# EAGLE design LiPoCharger (EAGLE 8.0.1)
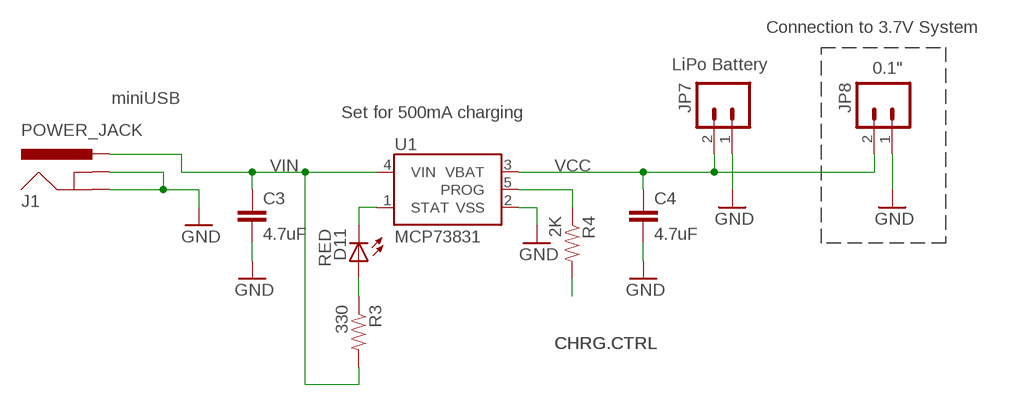
[diagram p0: schematic, sheet 1]

## Parts
C3  4.7uF  CAP0402-CAP  [0402-CAP]
C4  4.7uF  CAP0402-CAP  [0402-CAP]
D11  RED  LED0603  [LED-0603]
J1  POWER_JACK  [POWER_JACK_PTH]
JP7  LiPo Battery  M02-JST-2MM-SMT  [JST-2-SMD]
JP8  M02PTH  [1X02]
R3  330  RESISTOR0402-RES  [0402-RES]
R4  2K  RESISTOR0402-RES  [0402-RES]
U1  MCP73831  [SOT23-5]

## Nets
CHRG.CTRL: R4.2
GND: C3.2 C4.2 J1.GND J1.GNDBREAK JP7.1 JP8.1 U1.2(VSS)
N$3: D11.A R3.1
PROG: R4.1 U1.5(PROG)
STAT: D11.C U1.1(STAT)
VCC: C4.1 JP7.2 JP8.2 U1.3(VBAT)
VIN: C3.1 J1.PWR R3.2 U1.4(VIN)

## Notes on the sheet
- Connection to 3.7V System
- 0.1"
- miniUSB
- Set for 500mA charging

## Library data of the parts
C3 C4 = SparkFun:CAP: Capacitor Standard 0603 ceramic capacitor, and 0.1" leaded capacitor.
D11 = SparkFun:LED: LEDs Standard schematic elements and footprints for 5mm, 3mm, 1206, and 0603 sized LEDs. 5mm - Spark Fun Electronics SKU : COM-00529 (and others)
J1 = SparkFun-Connectors:POWER_JACK: Power Jack Connector This is the standard 5.5mm barrel jack for power. The PTH is the most common, proven, reliable, footprint. The Slot footprint only works if the mill layer is transmitted to the PCB fab house so be warned. Here are the connectors we sell at SparkFun: DC Barrel Power Jack/Connector <https://www.sparkfun.com/products/119> (PRT-00119) DC Barrel Power Jack/Connector (SMD) <https://www.sparkfun.com/products/12748> (PRT-12748) DC Barrel Jack Adapter - Breadboard Compatible <https://www.sparkfun.com/products/10811> (PRT-10811) It is used on this SparkFun product (and many, many others): SparkFun RedBoard - Programmed with Arduino <https://www.sparkfun.com/products/12757> (DEV-12757) Also, if you need a mating power supply or connector, please check these out: Wall Adapter Power Supply - 9VDC 650mA <https://www.sparkfun.com/products/298> (TOL-00298) DC Barrel Jack Adapter - Male <https://www.sparkfun.com/products/10287> (PRT-10287); PROD_ID: CONN-08197
JP7 JP8 = SparkFun:M02: Header 2 Standard 2-pin 0.1" header. Use with straight break away headers (SKU : PRT-00116), right angle break away headers (PRT-00553), swiss pins (PRT-00743), machine pins (PRT-00117), and female headers (PRT-00115). Molex polarized connector foot print use with SKU : PRT-08233 with associated crimp pins and housings.
R3 R4 = SparkFun:RESISTOR: Resistor Basic schematic elements and footprints for 0603, 1206, and PTH resistors.
U1 = SparkFun:MCP73831: Microchip's MCP73831 Miniature single cell, fully integrated Li-Ion, Li-polymer charge management controller http://ww1.microchip.com/downloads/en/DeviceDoc/21984a.pdf

## Net classes
0 default: width 0.203 mm

## Board
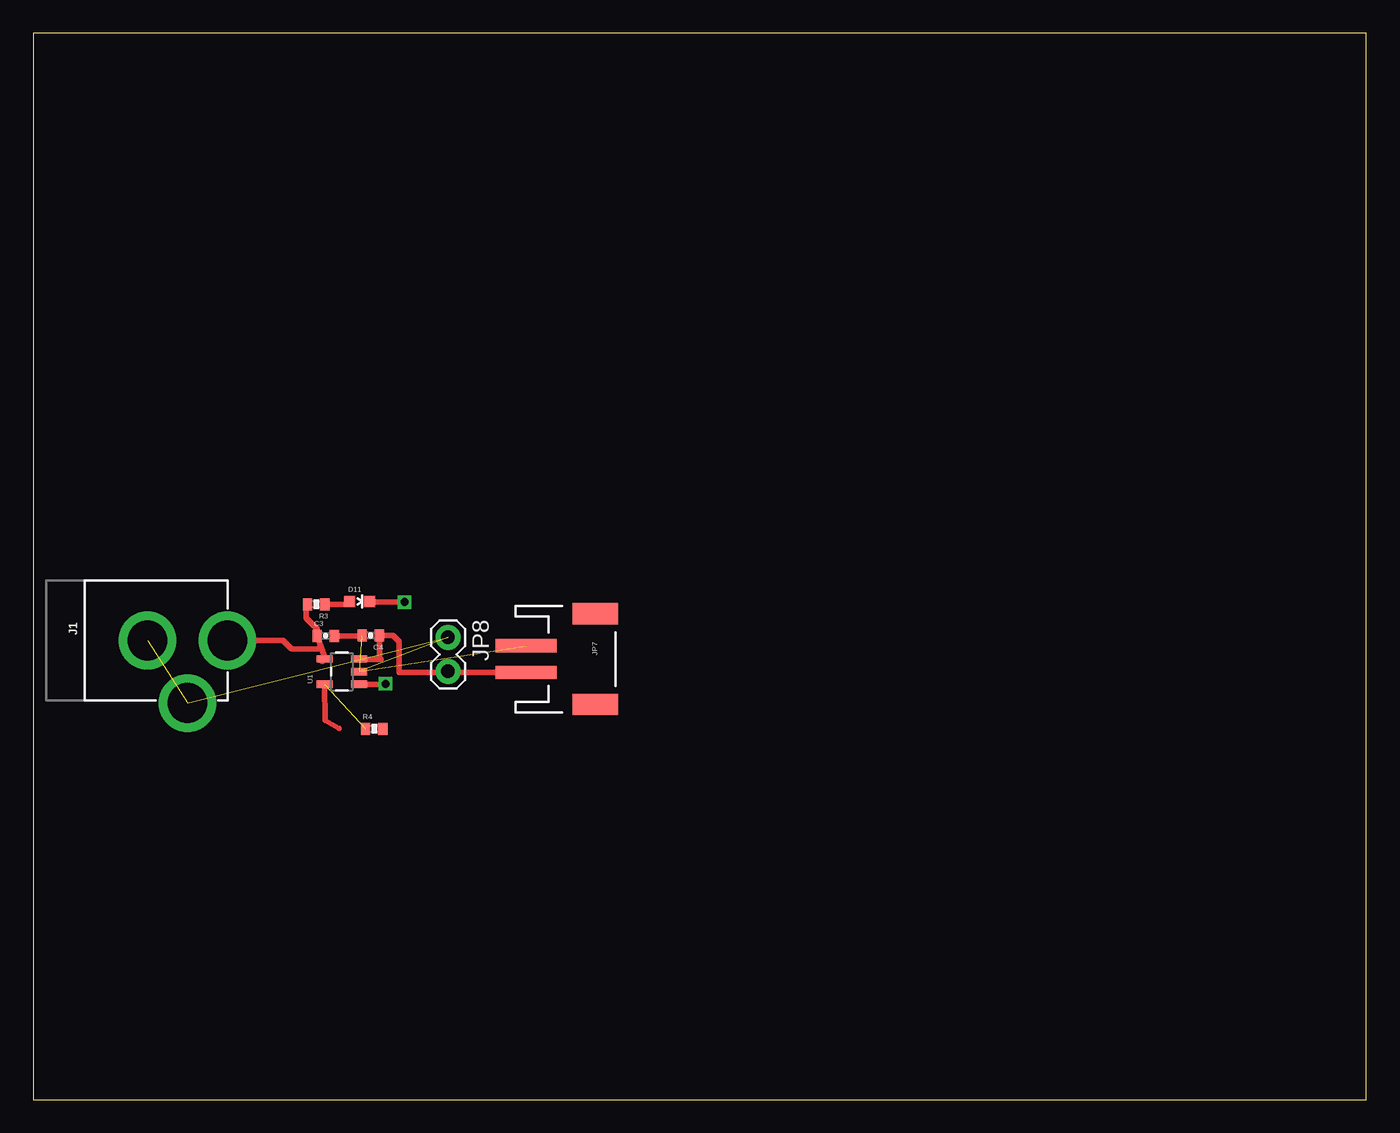
[diagram p1: board, top side]
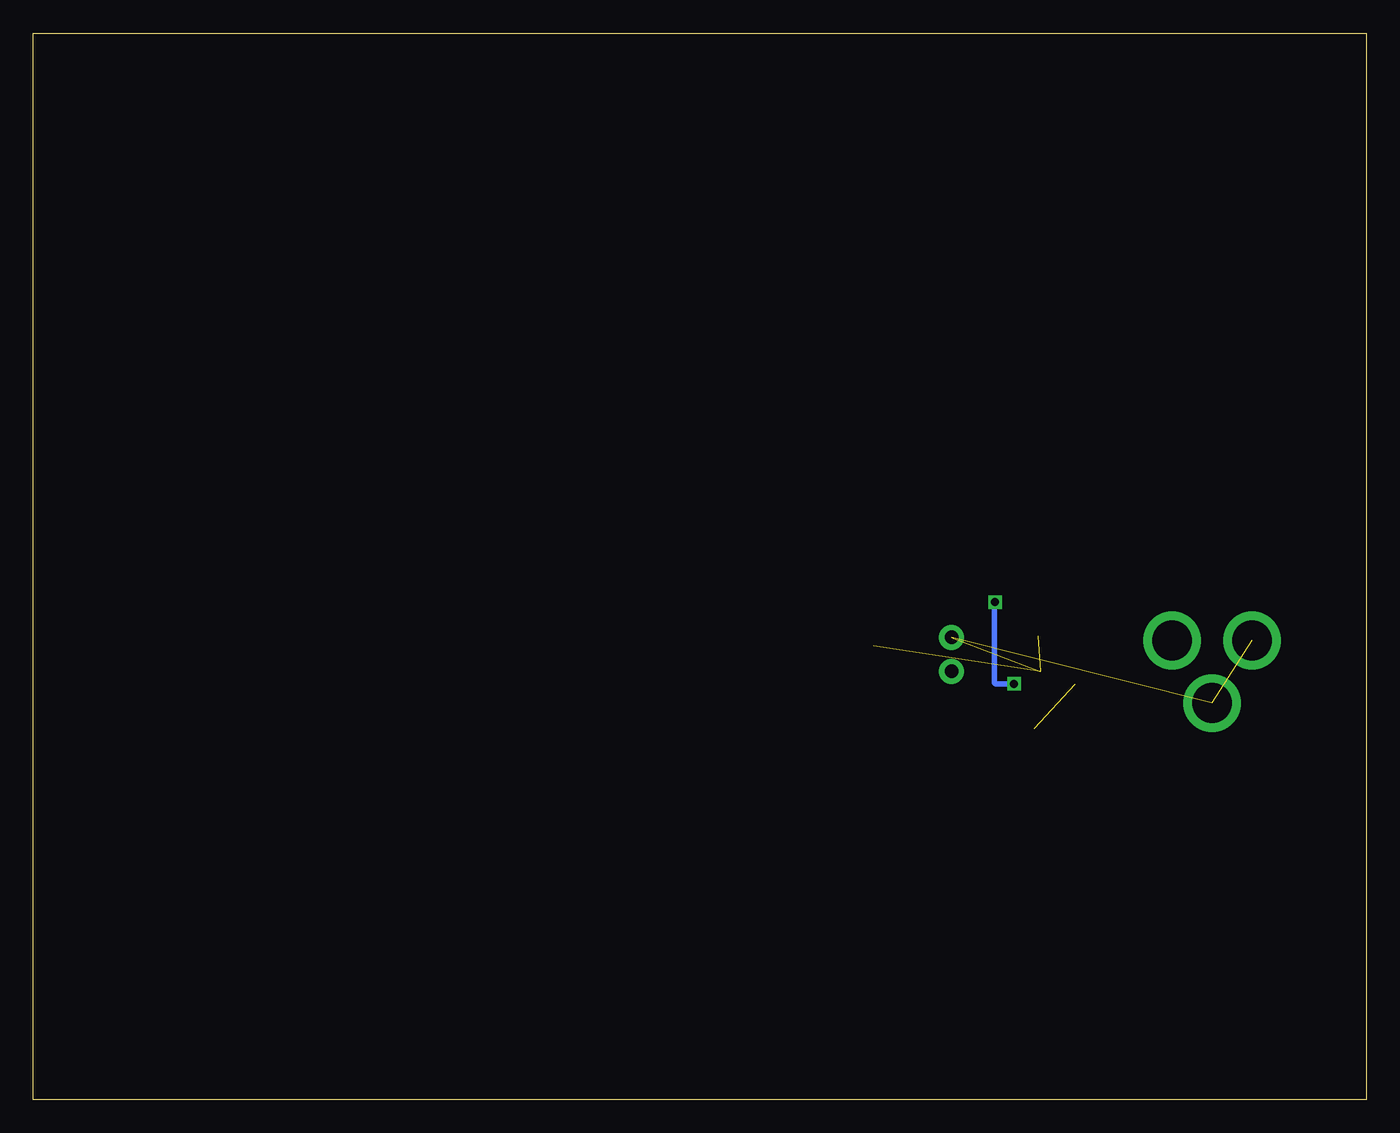
[diagram p2: board, bottom side, seen from below]

Size 100 x 80 mm. Coordinates in mm from the lower left corner, seen from the top.
Outline: 0,0 100,0 100,80 0,80 0,0
Copper layers (1*16): Top 0.035mm / dielectric 1.5mm / Bottom 0.035mm
Design rules "default": minimum track width 10mil, minimum drill 24mil, track to track 8mil, track to pad 8mil, pad to pad 8mil, via to via 8mil, smd to smd 8mil, copper to edge 40mil, drill to drill 8mil, minimum pad ring 10mil, minimum via ring 8mil, stop-mask expansion 4mil, vias tented up to drill 0mil, thermal gap 10mil

### Footprints (pad centres in the part's own frame; a part is rotated, then mirrored left to right if it is on the bottom)
0402-CAP = smd 0.7 x 0.9: 1 -0.65,0; 2 0.65,0
LED-0603 = smd 0.8 x 0.8: A 0,-0.75; C 0,0.75
POWER_JACK_PTH = drill 2.997 pad 4.318: GND 0,7.7; GNDBREAK 4.7,10.7; PWR 0,13.7
JST-2-SMD = smd 1 x 4.6: 1 -1,-3.7; 2 1,-3.7 | smd 1.6 x 3.4: NC1 -3.4,1.5; NC2 3.4,1.5
1X02 = drill 1.016 pad 1.88: 1 0,0; 2 2.54,0
0402-RES = smd 0.7 x 0.9: 1 -0.65,0; 2 0.65,0
SOT23-5 = smd 0.55 x 1.2: 1 -0.95,-1.3; 2 0,-1.3; 3 0.95,-1.3; 4 0.95,1.3; 5 -0.95,1.3

### Placement (x,y rotation side)
C3  21.95,34.8 0 top
C4  25.32,34.82 180 top
D11  24.49,37.36 270 top
J1  0.86,34.44 270 top
JP7  40.67,33.05 270 top
JP8  31.11,34.67 270 top
R3  21.23,37.16 180 top
R4  25.58,27.81 0 top
U1  23.14,32.11 90 top

### Tracks (layer width: path | path; a pad name or v marks a point on that pad's centre or on a via)
GND  (5 unrouted)
  Top 0.406: C3.2 24.65,34.8 C4.2
N$3
  Top 0.406: R3.1 23.53,37.16 D11.A
PROG  (1 unrouted)
  Top 0.406: U1.5 21.89,28.44 22.94,27.84
STAT  (via drill 0.6)
  Top 0.406: 24.68,31.17 U1.1 26.3,31.16 26.36,31.09 26.36,31.14 v26.42,31.19 | v27.84,37.31 25.29,37.31 D11.C
  Bottom 0.406: v26.42,31.19 27.79,31.19 27.89,31.29 27.89,37.26 v27.84,37.31 | v27.84,37.31 27.76,37.39 v27.84,37.31
VCC
  Top 0.406: U1.3 24.48,33.02 26.09,33.02 25.97,33.13 C4.1 27,34.82 27.46,34.37 27.46,32.05 27.48,32.03 31.01,32.03 JP8.2 | JP8.2 31.06,32.18 | JP7.2 31.2,32.05 JP8.2
VIN
  Top 0.406: 21.65,32.87 U1.4 21.84,33.21 21.63,33.83 | 21.63,33.83 C3.1 21.3,35.3 20.47,36.12 20.47,37.05 R3.2 | J1.PWR 18.75,34.44 19.38,33.81 21.6,33.81 21.63,33.83